# Altium project A540R260_4MB.PrjPcb
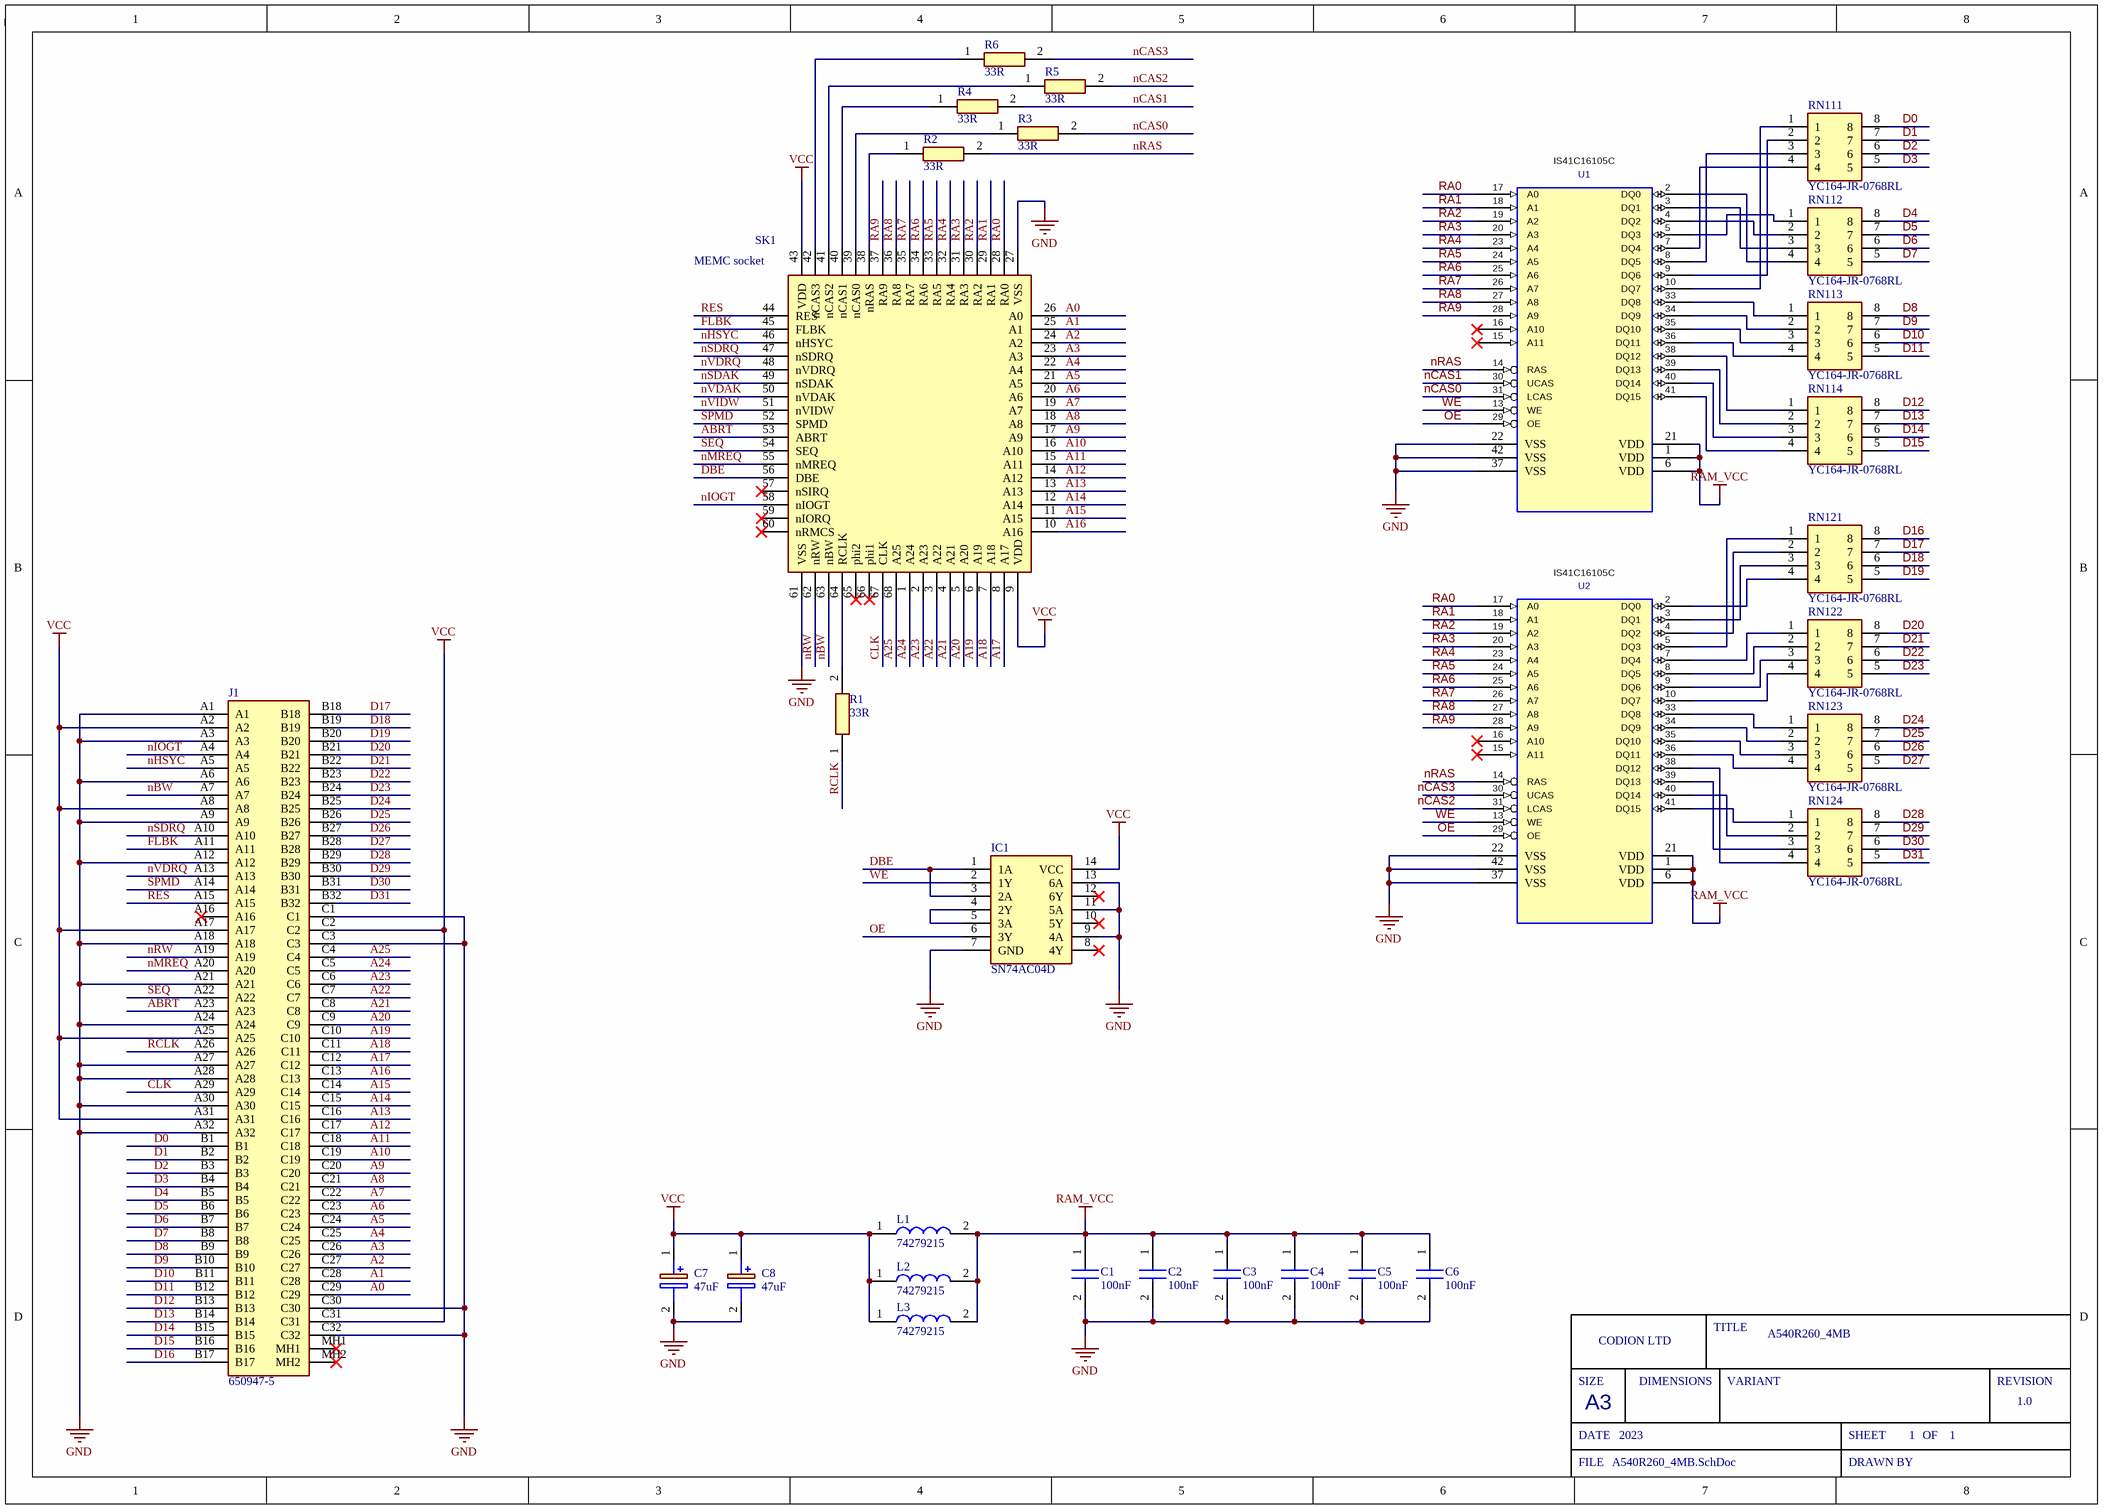
[diagram p0: A540R260_4MB.SchDoc]
Sch_RevNo: 1.0; Sch_releaseDate: 2023; Project_Title: A540R260_4MB; ProjectName: A540R260_4MB; PCB_RevNo: 1.0; Engineer_Name: Codion Ltd; BOM_RevNo: 1.0
1 sheet, 30 parts. Net scope: global (net labels, ports and power ports of the same name join across sheets).
Board file: A540R260_4MB.pcbdoc

## Sheet A540R260_4MB.SchDoc: ARM2 to ARM3 Adapter
size A3; DocumentNumber: 1; SheetNumber: 1; SheetTotal: 1

### Parts
C1  100nF  [CAPC2012X145N]
C2  100nF  [CAPC2012X145N]
C3  100nF  [CAPC2012X145N]
C4  100nF  [CAPC2012X145N]
C5  100nF  [CAPC2012X145N]
C6  100nF  [CAPC2012X145N]
C7  47uF  [EEE1AA101SP]
C8  47uF  [EEE1AA101SP]
IC1  SN74AC04D  [SOIC127P600X175-14N]
J1  650947-5  [6509475]
L1  74279215  [INDC3216X130N]
L2  74279215  [INDC3216X130N]
L3  74279215  [INDC3216X130N]
R1  33R  [RESC2012X60N]
R2  33R  [RESC2012X60N]
R3  33R  [RESC2012X60N]
R4  33R  [RESC2012X60N]
R5  33R  [RESC2012X60N]
R6  33R  [RESC2012X60N]
RN111  YC164-JR-0768RL  [YC164JR0768RL]
RN112  YC164-JR-0768RL  [YC164JR0768RL]
RN113  YC164-JR-0768RL  [YC164JR0768RL]
RN114  YC164-JR-0768RL  [YC164JR0768RL]
RN121  YC164-JR-0768RL  [YC164JR0768RL]
RN122  YC164-JR-0768RL  [YC164JR0768RL]
RN123  YC164-JR-0768RL  [YC164JR0768RL]
RN124  YC164-JR-0768RL  [YC164JR0768RL]
SK1  MEMC socket  [MEMC_Socket]
U1  IS41C16105C  [SOJ-42]
U2  IS41C16105C  [SOJ-42]

### Nets
GND: C1.2 C2.2 C3.2 C4.2 C5.2 C6.2 C7.2(-) C8.2(-) IC1.7(GND) IC1.9(4A) IC1.11(5A) IC1.13(6A) J1.A1 J1.A3 J1.A6 J1.A9 J1.A12 J1.A18 J1.A21 J1.A24 J1.A27 J1.A28 J1.A30 J1.A32 J1.C1 J1.C3 J1.C30 J1.C32 SK1.27(VSS) SK1.61(VSS) U1.22(VSS) U1.37(VSS) U1.42(VSS) U2.22(VSS) U2.37(VSS) U2.42(VSS)
RAM_VCC: C1.1 C2.1 C3.1 C4.1 C5.1 C6.1 L1.2 L2.2 L3.2 U1.1(VCC) U1.6(VCC) U1.21(VCC) U2.1(VCC) U2.6(VCC) U2.21(VCC)
VCC: C7.1(+) C8.1(+) IC1.14(VCC) J1.A2 J1.A8 J1.A17 J1.A25 J1.A31 J1.C2 J1.C31 L1.1 L2.1 L3.1 SK1.9(VDD) SK1.43(VDD)
A0: J1.C29 SK1.26(A0)
A1: J1.C28 SK1.25(A1)
A2: J1.C27 SK1.24(A2)
A3: J1.C26 SK1.23(A3)
A4: J1.C25 SK1.22(A4)
A5: J1.C24 SK1.21(A5)
A6: J1.C23 SK1.20(A6)
A7: J1.C22 SK1.19(A7)
A8: J1.C21 SK1.18(A8)
A9: J1.C20 SK1.17(A9)
A10: J1.C19 SK1.16(A10)
A11: J1.C18 SK1.15(A11)
A12: J1.C17 SK1.14(A12)
A13: J1.C16 SK1.13(A13)
A14: J1.C15 SK1.12(A14)
A15: J1.C14 SK1.11(A15)
A16: J1.C13 SK1.10(A16)
A17: J1.C12 SK1.8(A17)
A18: J1.C11 SK1.7(A18)
A19: J1.C10 SK1.6(A19)
A20: J1.C9 SK1.5(A20)
A21: J1.C8 SK1.4(A21)
A22: J1.C7 SK1.3(A22)
A23: J1.C6 SK1.2(A23)
A24: J1.C5 SK1.1(A24)
A25: J1.C4 SK1.68(A25)
ABRT: J1.A23 SK1.53(ABRT)
CLK: J1.A29 SK1.67(CLK)
D0: J1.B1 RN111.8
D1: J1.B2 RN111.7
D2: J1.B3 RN111.6
D3: J1.B4 RN111.5
D4: J1.B5 RN112.8
D5: J1.B6 RN112.7
D6: J1.B7 RN112.6
D7: J1.B8 RN112.5
D8: J1.B9 RN113.8
D9: J1.B10 RN113.7
D10: J1.B11 RN113.6
D11: J1.B12 RN113.5
D12: J1.B13 RN114.8
D13: J1.B14 RN114.7
D14: J1.B15 RN114.6
D15: J1.B16 RN114.5
D16: J1.B17 RN121.8
D17: J1.B18 RN121.7
D18: J1.B19 RN121.6
D19: J1.B20 RN121.5
D20: J1.B21 RN122.8
D21: J1.B22 RN122.7
D22: J1.B23 RN122.6
D23: J1.B24 RN122.5
D24: J1.B25 RN123.8
D25: J1.B26 RN123.7
D26: J1.B27 RN123.6
D27: J1.B28 RN123.5
D28: J1.B29 RN124.8
D29: J1.B30 RN124.7
D30: J1.B31 RN124.6
D31: J1.B32 RN124.5
DBE: IC1.1(1A) IC1.3(2A) SK1.56(DBE)
FLBK: J1.A11 SK1.45(FLBK)
nBW: J1.A7 SK1.63(nBW)
nCAS0: R3.2 U1.31(LCAS)
nCAS1: R4.2 U1.30(UCAS)
nCAS2: R5.2 U2.31(LCAS)
nCAS3: R6.2 U2.30(UCAS)
nHSYC: J1.A5 SK1.46(nHSYC)
nIOGT: J1.A4 SK1.58(nIOGT)
nMREQ: J1.A20 SK1.55(nMREQ)
nRAS: R2.2 U1.14(RAS) U2.14(RAS)
nRW: J1.A19 SK1.62(nRW)
nSDAK: SK1.49(nSDAK)
nSDRQ: J1.A10 SK1.47(nSDRQ)
nVDAK: SK1.50(nVDAK)
nVDRQ: J1.A13 SK1.48(nVDRQ)
nVIDW: SK1.51(nVIDW)
OE: IC1.6(3Y) U1.29(OE) U2.29(OE)
RA0: SK1.28(RA0) U1.17(A0) U2.17(A0)
RA1: SK1.29(RA1) U1.18(A1) U2.18(A1)
RA2: SK1.30(RA2) U1.19(A2) U2.19(A2)
RA3: SK1.31(RA3) U1.20(A3) U2.20(A3)
RA4: SK1.32(RA4) U1.23(A4) U2.23(A4)
RA5: SK1.33(RA5) U1.24(A5) U2.24(A5)
RA6: SK1.34(RA6) U1.25(A6) U2.25(A6)
RA7: SK1.35(RA7) U1.26(A7) U2.26(A7)
RA8: SK1.36(RA8) U1.27(A8) U2.27(A8)
RA9: SK1.37(RA9) U1.28(A9) U2.28(A9)
RCLK: J1.A26 R1.1
RES: J1.A15 SK1.44(RES)
SEQ: J1.A22 SK1.54(SEQ)
SPMD: J1.A14 SK1.52(SPMD)
WE: IC1.2(1Y) U1.13(WE) U2.13(WE)
NetIC1_4: IC1.4(2Y) IC1.5(3A)
NetR1_2: R1.2 SK1.64(RCLK)
NetR2_1: R2.1 SK1.38(nRAS)
NetR3_1: R3.1 SK1.39(nCAS0)
NetR4_1: R4.1 SK1.40(nCAS1)
NetR5_1: R5.1 SK1.41(nCAS2)
NetR6_1: R6.1 SK1.42(nCAS3)
NetRN111_1: RN111.1 U1.10(DQ7)
NetRN111_2: RN111.2 U1.9(DQ6)
NetRN111_3: RN111.3 U1.8(DQ5)
NetRN111_4: RN111.4 U1.7(DQ4)
NetRN112_1: RN112.1 U1.5(DQ3)
NetRN112_2: RN112.2 U1.4(DQ2)
NetRN112_3: RN112.3 U1.3(DQ1)
NetRN112_4: RN112.4 U1.2(DQ0)
NetRN113_1: RN113.1 U1.33(DQ8)
NetRN113_2: RN113.2 U1.34(DQ9)
NetRN113_3: RN113.3 U1.35(DQ10)
NetRN113_4: RN113.4 U1.36(DQ11)
NetRN114_1: RN114.1 U1.38(DQ12)
NetRN114_2: RN114.2 U1.39(DQ13)
NetRN114_3: RN114.3 U1.40(DQ14)
NetRN114_4: RN114.4 U1.41(DQ15)
NetRN121_1: RN121.1 U2.5(DQ3)
NetRN121_2: RN121.2 U2.4(DQ2)
NetRN121_3: RN121.3 U2.3(DQ1)
NetRN121_4: RN121.4 U2.2(DQ0)
NetRN122_1: RN122.1 U2.7(DQ4)
NetRN122_2: RN122.2 U2.8(DQ5)
NetRN122_3: RN122.3 U2.9(DQ6)
NetRN122_4: RN122.4 U2.10(DQ7)
NetRN123_1: RN123.1 U2.33(DQ8)
NetRN123_2: RN123.2 U2.34(DQ9)
NetRN123_3: RN123.3 U2.35(DQ10)
NetRN123_4: RN123.4 U2.36(DQ11)
NetRN124_1: RN124.1 U2.41(DQ15)
NetRN124_2: RN124.2 U2.40(DQ14)
NetRN124_3: RN124.3 U2.39(DQ13)
NetRN124_4: RN124.4 U2.38(DQ12)

Not connected (* = marked no-connect by the designer): IC1 8(4Y)* 10(5Y)* 12(6Y)*; J1 A16* MH1* MH2*; SK1 57(nSIRQ)* 59(nIORQ)* 60(nRMCS)* 65(phi2)* 66(phi1)*; U1 15(A11)* 16(A10)*; U2 15(A11)* 16(A10)*

### Notes on the sheet
- SIZE
- CODION LTD
- DIMENSIONS
- TITLE
- VARIANT
- REVISION
- DATE
- A3
- SHEET
- OF
- FILE
- DRAWN BY

### Library data of the parts
C1-C6 = C2012X7R1H104K125AM: Capacitor; Manufacturer_Name: TDK; Datasheet Link: https://product.tdk.com/info/en/catalog/datasheets/mlcc_commercial_midvoltage_en.pdf; Height: 1.45mm; Manufacturer_Part_Number: C2012X7R1H104K125AM; Mouser Part Number: 810-C2012X7R1H104KT5; Mouser Price/Stock: https://www.mouser.com/Search/Refine.aspx?Keyword=810-C2012X7R1H104KT5; Arrow Part Number: C2012X7R1H104K125AM; Arrow Price/Stock: https://www.arrow.com/en/products/c2012x7r1h104k125am/tdk
C7 C8 = EEE1VA470WP: Capacitor Polarised; Manufacturer_Name: Panasonic; Datasheet Link: http://industrial.panasonic.com/cdbs/www-data/pdf/RDE0000/ABA0000C1145.pdf; Height: 7.8mm; Manufacturer_Part_Number: EEE1VA470WP
IC1 = SN74AC04D: Integrated Circuit; Manufacturer_Name: Texas Instruments; Datasheet Link: http://www.ti.com/lit/ds/symlink/sn74ac04.pdf; Height: 1.75mm; Manufacturer_Part_Number: SN74AC04D; Mouser Part Number: 595-SN74AC04D; Mouser Price/Stock: https://www.mouser.co.uk/ProductDetail/Texas-Instruments/SN74AC04D?qs=w32V8uFkMxkvsyMHHacuZw%3D%3D; Arrow Part Number: SN74AC04D; Arrow Price/Stock: https://www.arrow.com/en/products/sn74ac04d/texas-instruments?region=nac
J1 = 650947-5: Connector; Manufacturer_Name: TE Connectivity; Datasheet Link: http://www.te.com/commerce/DocumentDelivery/DDEController?Action=srchrtrv&DocNm=650947&DocType=Customer+Drawing&DocLang=English; Height: 11.1mm; Manufacturer_Part_Number: 650947-5; Mouser Part Number: 571-6509475; Mouser Price/Stock: https://www.mouser.co.uk/ProductDetail/TE-Connectivity/650947-5?qs=A%252B%2FNCR0PvNW83cU5ePdpGw%3D%3D; Arrow Part Number: 650947-5; Arrow Price/Stock: https://www.arrow.com/en/products/650947-5/te-connectivity
L1-L3 = 74279215: Inductor; Manufacturer_Name: Wurth Elektronik; Datasheet Link: http://componentsearchengine.com/Datasheets/1/74279215.pdf; Height: 1.3mm; Manufacturer_Part_Number: 74279215; Mouser Part Number: 710-74279215; Mouser Price/Stock: https://www.mouser.co.uk/ProductDetail/Wurth-Elektronik/74279215?qs=5twSNpOB8IC%252BebnV0jQtuw%3D%3D
R1-R6 = RC0805FR-0733RL: Resistor; Manufacturer_Name: KEMET; Datasheet Link: http://www.yageo.com/documents/recent/PYu-RC_Group_51_RoHS_L_10.pdf; Height: 0.6mm; Manufacturer_Part_Number: RC0805FR-0733RL; Mouser Part Number: 603-RC0805FR-0733RL; Mouser Price/Stock: https://www.mouser.co.uk/ProductDetail/YAGEO/RC0805FR-0733RL?qs=g6xwsc4j%252B%2Fq7KbipsIEOLQ%3D%3D; Arrow Part Number: RC0805FR-0733RL; Arrow Price/Stock: https://www.arrow.com/en/products/rc0805fr-0733rl/yageo
RN111-RN114 RN121-RN124 = YC164-JR-0768RL: Resistor Network; Manufacturer_Name: KEMET; Datasheet Link: https://www.yageo.com/upload/media/product/productsearch/datasheet/rchip/PYu-YC_TC_group_51_RoHS_L_9.pdf; Height: 0.7mm; Manufacturer_Part_Number: YC164-JR-0768RL; Mouser Part Number: 603-YC164-JR-0768RL; Mouser Price/Stock: https://www.mouser.co.uk/ProductDetail/Yageo/YC164-JR-0768RL?qs=8cPjvKtxWv7AOp%2F0jDxI3w%3D%3D; Arrow Part Number: YC164-JR-0768RL; Arrow Price/Stock: https://www.arrow.com/en/products/yc164-jr-0768rl/yageo
SK1 = MEMC_Skt: Manufacturer_Name: 3M; Manufacturer_Part_Number: 8468-21B1-RK-TR; Datasheet Link: https://www.arrow.com/en/products/8468-21b1-rk-tr/3m; Height: 4.6mm; Mouser Part Number: 517-8468-21B1-RK-TR; Mouser Price/Stock: https://www.mouser.co.uk/ProductDetail/3M-Electronic-Solutions-Division/8468-21B1-RK-TR?qs=X%2F%2F06fXhnJ18zOj3KK47CQ%3D%3D; Arrow Part Number: 8468-21B1-RK-TR; Arrow Price/Stock: https://www.arrow.com/en/products/8468-21b1-rk-tr/3m
U1 U2 = DRAM_1MX16_SOJ: Value: IS41C16105C